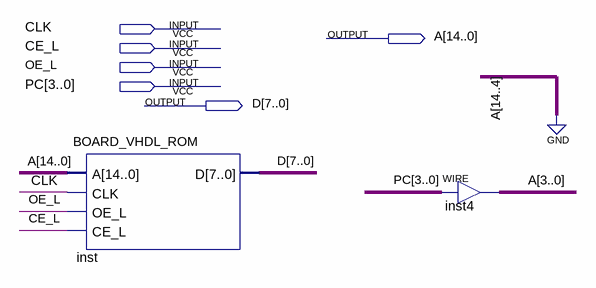
[diagram p0: schematic sheet]
// Quartus schematic ROM_test.bdf as structural Verilog: 2 symbols, 6 pins
module ROM_test (
  input  CLK,
  input  CE_L,
  input  OE_L,
  input  [3:0] PC,
  output [14:0] A,
  output [7:0] D
);

  BOARD_VHDL_ROM inst (.A({{11{1'b0}}, A[3:0]}), .CLK(CLK), .OE_L(OE_L), .CE_L(CE_L), .D(D));
  assign A[3:0] = PC;  // WIRE inst4

  assign A[14:4] = {11{1'b0}};
endmodule
